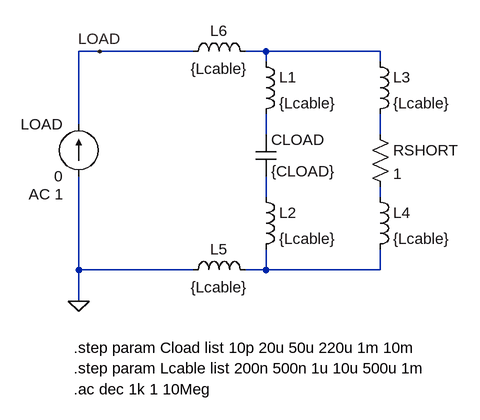
[diagram p0: schematic Load_Sim.asc]
Load_Sim.asc, the LTspice schematic file:
Version 4.1
SHEET 1 880 680
WIRE -112 16 -144 16
WIRE 32 16 -112 16
WIRE 144 16 112 16
WIRE 320 16 144 16
WIRE 144 32 144 16
WIRE 320 32 320 16
WIRE -144 128 -144 16
WIRE 144 144 144 112
WIRE 320 144 320 112
WIRE 144 240 144 208
WIRE 320 240 320 224
WIRE -144 352 -144 208
WIRE 32 352 -144 352
WIRE 144 352 144 320
WIRE 144 352 112 352
WIRE 320 352 320 320
WIRE 320 352 144 352
WIRE -144 400 -144 352
FLAG -144 400 0
FLAG -112 16 LOAD
SYMBOL ind 128 16 R0
SYMATTR InstName L1
SYMATTR Value {Lcable}
SYMBOL cap 128 144 R0
SYMATTR InstName CLOAD
SYMATTR Value {CLOAD}
SYMBOL ind 128 224 R0
SYMATTR InstName L2
SYMATTR Value {Lcable}
SYMBOL ind 304 16 R0
SYMATTR InstName L3
SYMATTR Value {Lcable}
SYMBOL ind 304 224 R0
SYMATTR InstName L4
SYMATTR Value {Lcable}
SYMBOL res 304 128 R0
SYMATTR InstName RSHORT
SYMATTR Value 1
SYMBOL ind 16 368 R270
WINDOW 0 32 56 VTop 2
WINDOW 3 5 56 VBottom 2
SYMATTR InstName L5
SYMATTR Value {Lcable}
SYMBOL ind 16 32 R270
WINDOW 0 32 56 VTop 2
WINDOW 3 5 56 VBottom 2
SYMATTR InstName L6
SYMATTR Value {Lcable}
SYMBOL current -144 208 R180
WINDOW 0 24 80 Left 2
WINDOW 3 24 0 Left 2
WINDOW 123 24 -28 Left 2
WINDOW 39 0 0 Left 0
SYMATTR InstName LOAD
SYMATTR Value 0
SYMATTR Value2 AC 1
TEXT -152 472 Left 2 !.step param Cload list 10p 20u 50u 220u 1m 10m\n.step param Lcable list 200n 500n 1u 10u 500u 1m
TEXT -152 536 Left 2 !.ac dec 1k 1 10Meg

The netlist it stands for:
* Load_Sim.asc
L1 N001 N002 {Lcable}
CLOAD N002 N004 {CLOAD}
L2 N004 N006 {Lcable}
L3 N001 N003 {Lcable}
L4 N005 N006 {Lcable}
RSHORT N003 N005 1
L5 0 N006 {Lcable}
L6 LOAD N001 {Lcable}
I§LOAD 0 LOAD 0 AC 1
.step param Cload list 10p 20u 50u 220u 1m 10m
.step param Lcable list 200n 500n 1u 10u 500u 1m
.ac dec 1k 1 10Meg
.backanno
.end